# Altium schematic sheet P1.schdoc
size 297 x 209 mm; Symbol: Drawing-Symbol_A4; Company: 嘉立创EDA; Version: V1.0; Page Size: A4; @Project Name: mini_scale; @Update Date: 2026-07-24; @Create Date: 2026-07-24; Device: Drawing-Symbol_A4; @Board Name: Board1; @Page Name: P1; @Create Time: 00:33:53; @Page Count: 1; @Page No: 1; @Schematic Name: Schematic1; @Update Time: 00:33:53; @Assembly Variant: Basic; Border: 1; Title Block Position: 3; Size: A4; Width: 1170; Height: 825; Region Start: 1; X Region Count: 6; Y Region Count: 4; Blade Width: 10; SheetNumber: 1; SheetTotal: 1
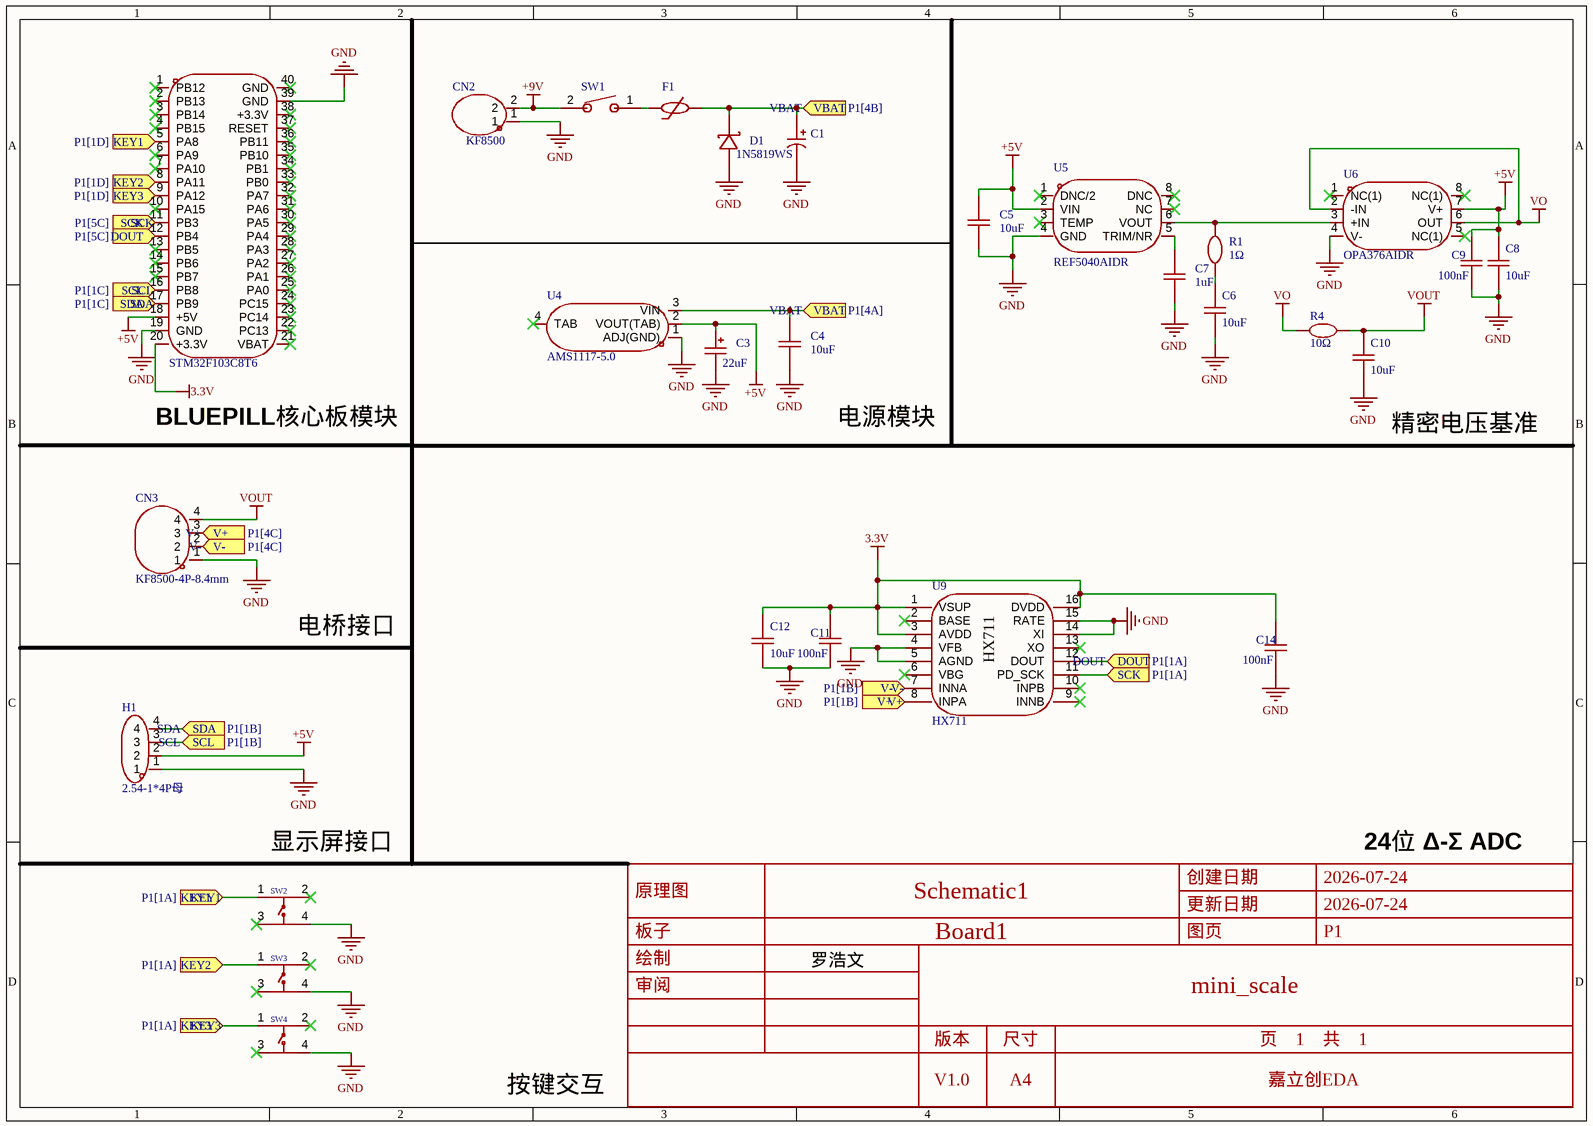
[diagram p0: P1.schdoc]

## Parts
C1  100uF  [CAP-SMD_BD6.3-L6.6-W6.6-FD-1]  (value not drawn)
C3  22uF  [CASE-A_3216]
C4  10uF  [C0805]
C5  10uF  [C0805]
C6  10uF  [C0805]
C7  1uF  [C0805]
C8  10uF  [C0805]
C9  100nF  [C0402]
C10  10uF  [C0805]
C11  100nF  [C0402]
C12  10uF  [C0805]
C14  100nF  [C0402]
CN2  KF8500  [CONN-TH_KF8500-2P-8.4MM]
CN3  KF8500-4P-8.4mm  [CONN-TH_KF8500-4P-8.4MM]
D1  1N5819WS  [SOD-323_L1.8-W1.3-LS2.5-RD]
F1  SMD0805-100-12  [R0805]  (value not drawn)
H1  2.54-1*4P母  [HDR-TH_4P-P2.54-V-F]
R1  1Ω  [R1206]
R4  10Ω  [R0805]
SW1  RS601HL-1010011BB  [SW-TH_RS601HL-1010011BB]  (value not drawn)
SW2  TS1603-TZ60HBM  [SW-SMD_4P-L4.5-W4.5-P3.00-LS6.8-1]  (value not drawn)
SW3  TS1603-TZ60HBM  [SW-SMD_4P-L4.5-W4.5-P3.00-LS6.8-1]  (value not drawn)
SW4  TS1603-TZ60HBM  [SW-SMD_4P-L4.5-W4.5-P3.00-LS6.8-1]  (value not drawn)
U2  STM32F103C8T6  [CONN-TH_L53.3-W22.9_STM32F103C8T6-CARD]
U4  AMS1117-5.0  [SOT-223_L6.7-W3.5-P2.30-BR]
U5  REF5040AIDR  [SOIC-8_L4.9-W3.9-P1.27-LS6.0-BL]
U6  OPA376AIDR  [SOIC-8_L4.9-W3.9-P1.27-LS6.0-BL]
U9  HX711  [SOP-16_L10.0-W3.9-P1.27-LS6.0-BL]

## Ports
DOUT (in, see P1[1A]), DOUT (in, see P1[5C]), KEY1 (in, see P1[1A]), KEY1 (in, see P1[1D]), KEY2 (in, see P1[1A]), KEY2 (in, see P1[1D]), KEY3 (in, see P1[1A]), KEY3 (in, see P1[1D]), SCK (in, see P1[1A]), SCK (in, see P1[5C]), SCL (in, see P1[1B]), SCL (in, see P1[1C]), SDA (in, see P1[1B]), SDA (in, see P1[1C]), V+ (in, see P1[1B]), V+ (in, see P1[4C]), V- (in, see P1[1B]), V- (in, see P1[4C]), VBAT (in, see P1[4A]), VBAT (in, see P1[4B])

## Nets
3.3V: C11.2 C12.2 C14.2 U2.20(+3.3V) U9.1(VSUP) U9.3(AVDD) U9.16(DVDD)
+5V: C3.1 C5.2 C8.2 C9.2 H1.2 U2.18(+5V) U4.2(VOUT(TAB)) U5.2(VIN) U6.7(V+)
+9V: CN2.2 SW1.2
GND: C1.2 C3.2 C4.1 C5.1 C6.1 C7.1 C8.1 C9.1 C10.1 C11.1 C12.1 C14.1 CN2.1 CN3.1 D1.2(A) H1.1 SW2.4 SW3.4 SW4.4 U2.19(GND) U2.39(GND) U4.1(ADJ(GND)) U5.4(GND) U6.4(V-) U9.4(VFB) U9.5(AGND) U9.14(XI) U9.15(RATE)
VO: R4.1 U6.2(-IN) U6.6(OUT)
VOUT: C10.2 CN3.4 R4.2
DOUT: U2.12(PB4) U9.12(DOUT) ; port DOUT
KEY1: SW2.1 U2.5(PA8) ; port KEY1
KEY2: SW3.1 U2.8(PA11) ; port KEY2
KEY3: SW4.1 U2.9(PA12) ; port KEY3
SCK: U2.11(PB3) U9.11(PD_SCK) ; port SCK
SCL: H1.3 U2.16(PB8) ; port SCL
SDA: H1.4 U2.17(PB9) ; port SDA
V+: CN3.3 U9.8(INPA) ; port V+
V-: CN3.2 U9.7(INNA) ; port V-
VBAT: C1.1 C4.2 D1.1(K) F1.2 U4.3(VIN) ; port VBAT
NetC6_2: C6.2 R1.1
NetC7_2: C7.2 U5.5(TRIM/NR)
NetF1_1: F1.1 SW1.1
NetR1_2: R1.2 U5.6(VOUT) U6.3(+IN)

Not connected (* = marked no-connect by the designer): SW2 2* 3*; SW3 2* 3*; SW4 2* 3*; U2 1(PB12)* 2(PB13)* 3(PB14)* 4(PB15)* 6(PA9)* 7(PA10)* 10(PA15)* 13(PB5)* 14(PB6)* 15(PB7)* 21(VBAT)* 22(PC13)* 23(PC14)* 24(PC15)* 25(PA0)* 26(PA1)* 27(PA2)* 28(PA3)* 29(PA4)* 30(PA5)* 31(PA6)* 32(PA7)* 33(PB0)* 34(PB1)* 35(PB10)* 36(PB11)* 37(RESET)* 38(+3.3V)* 40(GND)*; U4 4(TAB)*; U5 1(DNC/2)* 3(TEMP)* 7(NC)* 8(DNC)*; U6 1(NC(1))* 5(NC(1))* 8(NC(1))*; U9 2(BASE)* 6(VBG)* 9(INNB)* 10(INPB)* 13(XO)*

## Notes on the sheet
- BLUEPILL核心板模块
- 电源模块
- (near C10) 精密电压基准
- 电桥接口
- (near SW2) 显示屏接口
- 24位 Δ-Σ ADC
- 罗浩文
- 按键交互
- 创建日期
- 2026-07-24
- 原理图
- 板子
- Schematic1
- Board1
- 更新日期
- 图页
- P1
- 绘制
- 审阅
- mini_scale
- 版本
- V1.0
- 尺寸
- A4
- 页    1    共    1
- 嘉立创EDA

## Library data of the parts
C1 = JVJ25V100M6x5: 容值:100uF;精度:±20%;额定电压:25V;纹波电流:72mA@120Hz;; Manufacturer: JIERR(捷而瑞); AddInBom: yes; ModelId: 041333f082e2432d92aae8a67d233574|0819f05c4eef4c71ace90d822a990e87; ModelTransform: 299.212,259.842,0,0,0,0,0,0,0; Tolerance: ±20%; Voltage Rating: 25V; Lifetime: 2000hrs@105℃; Symbol: JVJ25V100M6X5; Device: JVJ25V100M6x5; LCSC Part Name: 100uF ±20% 25V; SupplierPart: C46550402; ManufacturerPart: JVJ25V100M6x5; Supplier Footprint: SMD,D6.3xL5.4mm; JLCPCB Part Class: Extended Part; Datasheet: https://item.szlcsc.com/datasheet/JVJ25V100M6x5/48680096.html; Supplier: LCSC; ConvertToPcb: yes; FootprintName: CAP-SMD_BD6.3-L6.6-W6.6-FD-1; ModelName: CAP-SMD_BD6.3-L6.6-W6.6-FD-1; Value: 100uF; Ripple Current: 72mA@120Hz; Diameter: 6.3mm; Height - Seated (Max): 5.4mm; Operating Temperature: -55℃~+105℃
C3 = TAJA226K010RNJ: 容值:22uF;精度:±10%;额定电压:10V;等效串联电阻(ESR):3Ω@100kHz;; Manufacturer: Kyocera AVX; AddInBom: yes; ModelId: 803ac3def75e4c7cb895540fe23dd6a1|0819f05c4eef4c71ace90d822a990e87; ModelTransform: 125.984,62.992,0,0,0,0,0,0,0; Tolerance: ±10%; Voltage Rating: 10V; Symbol: TAJA226K010RNJ; Device: TAJA226K010RNJ; LCSC Part Name: 22uF ±10% 10V; SupplierPart: C11366; ManufacturerPart: TAJA226K010RNJ; Supplier Footprint: CASE-A-3216-18(mm); JLCPCB Part Class: Extended Part; Supplier: LCSC; ConvertToPcb: yes; FootprintName: CASE-A_3216; ModelName: CASE-A_3216; Value: 22uF; Equivalent Series Resistance(ESR): 3Ω@100kHz; Operating Temperature: -55℃~+125℃
C4 = CGA0805X5R106K250MT: 容值:10uF;精度:±10%;额定电压:25V;温度系数:X5R;; Manufacturer: HRE(芯声); AddInBom: yes; ModelId: 1ba041120af144c991958decab20d241|0819f05c4eef4c71ace90d822a990e87; ModelName: C0805_L2.0-W1.3-H1.3; ModelTransform: 78.74,51.181,0,0,0,0,0,0.0005,0; Tolerance: ±10%; Voltage Rating: 25V; Temperature Coefficient: X5R; Symbol: CGA0805X5R106K250MT; Device: CGA0805X5R106K250MT; LCSC Part Name: 10uF ±10% 25V; SupplierPart: C6119887; ManufacturerPart: CGA0805X5R106K250MT; Supplier Footprint: 0805; JLCPCB Part Class: Extended Part; Datasheet: https://item.szlcsc.com/datasheet/CGA0805X5R106K250MT/7062593.html; Supplier: LCSC; ConvertToPcb: yes; FootprintName: C0805; Value: 10uF
C5 C6 C8 C10 C12 = CGA0805X5R106K250MT: 容值:10uF;精度:±10%;额定电压:25V;温度系数:X5R;; Manufacturer: HRE(芯声); 3D Model: 1ba041120af144c991958decab20d241|0819f05c4eef4c71ace90d822a990e87; 3D Model Transform: 78.74,51.181,0,0,0,0,0,0.0005,0; Tolerance: ±10%; Voltage Rating: 25V; Temperature Coefficient: X5R; AddInBom: yes; ModelName: C0805_L2.0-W1.3-H1.3; Symbol: CGA0805X5R106K250MT; Device: CGA0805X5R106K250MT; LCSC Part Name: 10uF ±10% 25V; Supplier Part: C6119887; Manufacturer Part: CGA0805X5R106K250MT; Supplier Footprint: 0805; JLCPCB Part Class: Extended Part; Datasheet: https://item.szlcsc.com/datasheet/CGA0805X5R106K250MT/7062593.html; Supplier: LCSC; Value: 10uF; ConvertToPcb: yes; FootprintName: C0805
C7 = CGA0805X7R105K500MT: 容值:1uF;精度:±10%;额定电压:50V;温度系数:X7R;; Manufacturer: HRE(芯声); AddInBom: yes; ModelId: 1ba041120af144c991958decab20d241|0819f05c4eef4c71ace90d822a990e87; ModelName: C0805_L2.0-W1.3-H1.3; ModelTransform: 78.74,51.181,0,0,0,0,0,0.0005,0; Tolerance: ±10%; Voltage Rating: 50V; Temperature Coefficient: X7R; Symbol: CGA0805X7R105K500MT; Device: CGA0805X7R105K500MT; LCSC Part Name: 1uF ±10% 50V; SupplierPart: C6119929; ManufacturerPart: CGA0805X7R105K500MT; Supplier Footprint: 0805; JLCPCB Part Class: Extended Part; Datasheet: https://item.szlcsc.com/datasheet/CGA0805X7R105K500MT/7062635.html; Supplier: LCSC; ConvertToPcb: yes; FootprintName: C0805; Value: 1uF
C9 = CC0402KRX7R7BB104: 容值:100nF;精度:±10%;额定电压:16V;温度系数:X7R;; Manufacturer: YAGEO(国巨); AddInBom: yes; ModelId: 36a51122f27c49738f86b3bfa98863e0|0819f05c4eef4c71ace90d822a990e87; ModelName: C0402_L1.0-W0.5-H0.5; ModelTransform: 39.37,19.685,0,0,0,0,0,0,0; Tolerance: ±10%; Voltage Rating: 16V; Temperature Coefficient: X7R; Symbol: CC0402KRX7R7BB104; Device: CC0402KRX7R7BB104; LCSC Part Name: 100nF ±10% 16V; SupplierPart: C60474; ManufacturerPart: CC0402KRX7R7BB104; Supplier Footprint: 0402; JLCPCB Part Class: Extended Part; Datasheet: https://item.szlcsc.com/datasheet/CC0402KRX7R7BB104/61526.html; Supplier: LCSC; ConvertToPcb: yes; FootprintName: C0402; Value: 100nF
C11 C14 = CC0402KRX7R7BB104: 容值:100nF;精度:±10%;额定电压:16V;温度系数:X7R;; Manufacturer: YAGEO(国巨); 3D Model: 36a51122f27c49738f86b3bfa98863e0|0819f05c4eef4c71ace90d822a990e87; 3D Model Transform: 39.37,19.685,0,0,0,0,0,0,0; Tolerance: ±10%; Voltage Rating: 16V; Temperature Coefficient: X7R; AddInBom: yes; ModelName: C0402_L1.0-W0.5-H0.5; Symbol: CC0402KRX7R7BB104; Device: CC0402KRX7R7BB104; LCSC Part Name: 100nF ±10% 16V; Supplier Part: C60474; Manufacturer Part: CC0402KRX7R7BB104; Supplier Footprint: 0402; JLCPCB Part Class: Extended Part; Datasheet: https://item.szlcsc.com/datasheet/CC0402KRX7R7BB104/61526.html; Supplier: LCSC; Value: 100nF; ConvertToPcb: yes; FootprintName: C0402
CN2 = KF8500-2p-8.4MM: 隔板类型:两面;间距:8.5mm;结构:1x2P;安装方式:直插;引脚位置:边脚;排数:1;每排PIN数:2;额定电流:20A;额定电压:300V;线规 - AWG:12~22;线规 - 平方毫米:-;工作温度:-40℃~+105℃;颜色:绿色;; Manufacturer: BOOMELE(博穆精密); AddInBom: yes; ModelId: c30898623fc1485dab84d6a2e80a09f9|0819f05c4eef4c71ace90d822a990e87; ModelTransform: 708.66,472.44,0,0,0,0,19.685,-156.889,-185.039; Barrier Type: 两面; Pitch: 8.5mm; Number of Positions or Pins: 1x2P; Pin Location: 边脚; Number of PINs Per Row: 2; Current Rating: 20A; Voltage Rating (Max): 300V; Wire Gauge - AWG: 12~22; Symbol: KF8500-2P-8.4MM; Device: KF8500-2p-8.4MM; Manufacturer Part: KF8500; LCSC Part Name: 8.5mm 1x2P 直插 边脚 排数:1 每排P数:2; SupplierPart: C42860; Supplier Footprint: 插件,P=8.5mm; JLCPCB Part Class: Extended Part; Datasheet: https://item.szlcsc.com/datasheet/KF8500-2p-8.4MM/43851.html; Supplier: LCSC; ConvertToPcb: yes; FootprintName: CONN-TH_KF8500-2P-8.4MM; ModelName: CONN-TH_KF8500-2P-8.4MM; Mounting Type: 直插; Number of Pins: 2P; Number of Rows: 1; Wire Gauge - mm2: -; Operating Temperature: -40℃~+105℃; Color: 绿色
CN3 = KF8500-4P-8.4mm: Manufacturer: BOOMELE(博穆精密); AddInBom: yes; ModelId: e5b8ee24f4544fd3935b2de5555f3f62|0819f05c4eef4c71ace90d822a990e87; ModelTransform: 1322.83192,496.062,0,0,0,0,0,-133.858,-196.85; Symbol: KF8500-4P-8.4MM; Device: KF8500-4P-8.4mm; LCSC Part Name: 接线端子 KF8500-4P-8.4mm; SupplierPart: C24671; ManufacturerPart: KF8500-4P-8.4mm; Supplier Footprint: 插件,P=8.4mm; JLCPCB Part Class: Extended Part; Supplier: LCSC; ConvertToPcb: yes; FootprintName: CONN-TH_KF8500-4P-8.4MM; ModelName: CONN-TH_KF8500-4P-8.4MM
D1 = 1N5819WS_C191023: 正向压降(Vf):600mV@1A;直流反向耐压(Vr):40V;整流电流:1A;; Manufacturer: Hottech(合科泰); AddInBom: yes; ModelId: db63db13d9e342eb939127d413d6200b|0819f05c4eef4c71ace90d822a990e87; ModelTransform: 104.3305,51.181,0,0,0,0,0,-0.004,0; Voltage - DC Reverse(Vr): 40V; Current - Rectified: 1A; Non-Repetitive Peak Forward Surge Current: 25A; Symbol: 1N5819WS; Device: 1N5819WS_C191023; LCSC Part Name: 电压:40V 电流:1A; SupplierPart: C191023; ManufacturerPart: 1N5819WS; Supplier Footprint: SOD-323; JLCPCB Part Class: Basic Part; Datasheet: https://item.szlcsc.com/datasheet/1N5819WS/213850.html; Supplier: LCSC; ConvertToPcb: yes; FootprintName: SOD-323_L1.8-W1.3-LS2.5-RD; ModelName: SOD-323_L1.8-W1.3-LS2.5-RD; Voltage - Forward(Vf@If): 600mV@1A
F1 = SMD0805-100-12: 耐压(Vmax):12V;最大电流(Imax):40A;保持电流(Ihold):1A;跳闸电流(Itrip):2A;; Manufacturer: R+O(宏嘉诚); AddInBom: yes; ModelId: 37a81e68749a4138bd2dfa6897b24b85|0819f05c4eef4c71ace90d822a990e87; ModelName: R0805_L2.0-W1.3-H0.6; ModelTransform: 78.74,51.181,0,0,0,0,0,-0.0005,0; Voltage - Max: 12V; Current - Max: 40A; Hold Current: 1A; Trip Current: 2A; Power Dissipation: 600mW; Resistance - Initial (Ri) (Min): 40mΩ; Resistance - Post Trip (R1) (Max): 270mΩ; Time to Trip(Max): 300ms; Symbol: SMD0805-100-12; Device: SMD0805-100-12; LCSC Part Name: 12V 1A; SupplierPart: C46640991; ManufacturerPart: SMD0805-100-12; Supplier Footprint: 0805; JLCPCB Part Class: Extended Part; Datasheet: https://item.szlcsc.com/datasheet/SMD0805-100-12/48798697.html; Supplier: LCSC; ConvertToPcb: yes; FootprintName: R0805; Operating Temperature: -40℃~+85℃; Length: 2.2mm; Width: 1.5mm
H1 = 2.54-1*4P母: 插孔结构:1x4P;间距:2.54mm;行距:-;圆孔/方孔:方孔;安装方式:直插;排数:单排;总孔位数:4P;额定电流:3A;额定电压:-;插孔方向:顶部;塑高:-;触头材质:青铜;触头镀层:-;工作温度:-40℃~+105℃;; Manufacturer: BOOMELE(博穆精密); AddInBom: yes; ModelId: d187812051054f85879fcaa51a310d8e|0819f05c4eef4c71ace90d822a990e87; ModelTransform: 419.6842,98.464,0,0,0,0,0,0,-118.11; Holes Structure: 1x4P; Pitch: 2.54mm; Circular Hole / Square Hole: 方孔; Number of Positions: 4P; Current Rating: 3A; Holes Direction: 顶部; Symbol: 2.54-1*4P母; Device: 2.54-1*4P母; LCSC Part Name: 间距:2.54mm 1x4P 直插; SupplierPart: C2718488; ManufacturerPart: 2.54-1*4P母; Supplier Footprint: 插件,P=2.54mm; JLCPCB Part Class: Extended Part; Datasheet: https://item.szlcsc.com/datasheet/2.54-1*4P%25E6%25AF%258D/2834502.html; Supplier: LCSC; ConvertToPcb: yes; FootprintName: HDR-TH_4P-P2.54-V-F; ModelName: HDR-TH_4P-P2.54-V-F; Row Spacing: -; Mounting Type: 直插; Number of Rows: 单排; Voltage Rating (Max): -; Insulation Height: -; Contact Material: 青铜; Contact Plating: -; Operating Temperature: -40℃~+105℃
R1 = FRC1206J1R0 TS: 电阻类型:厚膜电阻;阻值:1Ω;精度:±5%;功率:250mW;工作电压:200V;温度系数:±400ppm/℃;; Manufacturer: FOJAN(富捷); AddInBom: yes; ModelId: 89a1f13db2384da588040e0b3c55bf66|0819f05c4eef4c71ace90d822a990e87; ModelName: R1206_L3.2-W1.6-H0.6; ModelTransform: 125.984,62.992,0,0,0,0,0,0,0; Tolerance: ±5%; Power(Watts): 250mW; Voltage-Supply(Max): 200V; Symbol: FRC1206J1R0 TS; Device: FRC1206J1R0 TS; LCSC Part Name: 1Ω ±5% 250mW 厚膜电阻; SupplierPart: C2907442; ManufacturerPart: FRC1206J1R0 TS; Supplier Footprint: 1206; JLCPCB Part Class: Extended Part; Datasheet: https://item.szlcsc.com/datasheet/FRC1206J1R0%2520TS/3180955.html; Supplier: LCSC; ConvertToPcb: yes; FootprintName: R1206; Type: 厚膜电阻; Value: 1Ω; Temperature Coefficient: ±400ppm/℃; Operating Temperature: -55℃~+155℃
R4 = FRC0805J100 TS: 电阻类型:厚膜电阻;阻值:10Ω;精度:±5%;功率:125mW;工作电压:150V;温度系数:±200ppm/℃;; Manufacturer: FOJAN(富捷); AddInBom: yes; ModelId: 37a81e68749a4138bd2dfa6897b24b85|0819f05c4eef4c71ace90d822a990e87; ModelName: R0805_L2.0-W1.3-H0.6; ModelTransform: 78.74,51.181,0,0,0,0,0,-0.0005,0; Tolerance: ±5%; Power(Watts): 125mW; Voltage-Supply(Max): 150V; Symbol: FRC0805J100 TS; Device: FRC0805J100 TS; LCSC Part Name: 10Ω ±5% 125mW 厚膜电阻; SupplierPart: C2907296; ManufacturerPart: FRC0805J100 TS; Supplier Footprint: 0805; JLCPCB Part Class: Extended Part; Datasheet: https://item.szlcsc.com/datasheet/FRC0805J100%2520TS/3180809.html; Supplier: LCSC; ConvertToPcb: yes; FootprintName: R0805; Type: 厚膜电阻; Value: 10Ω; Temperature Coefficient: ±200ppm/℃; Operating Temperature: -55℃~+155℃
SW1 = RS601HL-1010011BB: 带灯:无;引脚样式:焊片;额定电流:3A;额定电压(AC):250V;额定电压(DC):-;电路结构:单刀单掷;工作寿命:1万次;; Manufacturer: HCTL(华灿天禄); AddInBom: yes; ModelId: cac6664e7827407e8024fa0ea95caa3c|0819f05c4eef4c71ace90d822a990e87; ModelTransform: 590.55,413.385,0,0,0,0,97.83,0,-196.85; Actuator Type: 凹面弯曲; With Lamp: 无; Actuator Color: 黑色; Current Rating: 3A; Voltage Rating (AC): 250V; Circuit: 单刀单掷; Life: 1万次; Actuator Identifier: - O; Symbol: RS601HL-1010011BB; Device: RS601HL-1010011BB; LCSC Part Name: RS601HL-1010011BB; SupplierPart: C2885782; ManufacturerPart: RS601HL-1010011BB; Supplier Footprint: 插件,15x10.5mm; JLCPCB Part Class: Extended Part; Datasheet: https://item.szlcsc.com/datasheet/RS601HL-1010011BB/3096684.html; Supplier: LCSC; ConvertToPcb: yes; FootprintName: SW-TH_RS601HL-1010011BB; ModelName: SW-TH_RS601HL-1010011BB; Length: 15mm; Width: 10.5mm; Switch Height: -; Termination Style: 焊片; Voltage Rating (DC): -; Operating Temperature: -25℃~+85℃
SW2-SW4 = TS1603-TZ60HBM: 电路结构:单刀单掷;按钮形状:圆形按钮;安装方式:立贴;开关长度:4.5mm;开关宽度:4.5mm;开关高度:6mm;带支架:不带支架;触点电流:50mA;额定电压:12V;带灯:无;; Manufacturer: BXCONN(宝讯); AddInBom: yes; ModelId: 725d6a1b23d74dddbea84bcfb83358d8|0819f05c4eef4c71ace90d822a990e87; ModelTransform: 267.716,177.559,0,0,0,0,0,0,0; Circuit: 单刀单掷; Actuator Style: 圆形按钮; Switch Height: 6mm; with Bracket: 不带支架; Contact Current: 50mA; Voltage Rating: 12V; Actuator/Cap Color: 黑色; With Lamp: 无; Symbol: TS1603-TZ60HBM; Device: TS1603-TZ60HBM; LCSC Part Name: 4.5*4.5*6.0 立贴   轻触开关; SupplierPart: C36938891; ManufacturerPart: TS1603-TZ60HBM; Supplier Footprint: SMD-4P,4.5x4.5mm; JLCPCB Part Class: Extended Part; Datasheet: https://item.szlcsc.com/datasheet/TS1603-TZ60HBM/38663761.html; Supplier: LCSC; ConvertToPcb: yes; FootprintName: SW-SMD_4P-L4.5-W4.5-P3.00-LS6.8-1; ModelName: SW-SMD_4P-L4.5-W4.5-P3.00-LS6.8-1; Mounting Type: 立贴; Length: 4.5mm; Width: 4.5mm; Termination Style: 鸥翼型
U2 = LCKFB-DKX-STM32F103C8T6: 搭载Contex M3内核,程序存储容量64KB,RAM总容量20KB,最高72MHz主频,提供高效的计算能力和稳定的运行环境。; Manufacturer: 立创开发板; AddInBom: yes; ModelId: 70cdd142a616427fa7f75b03dcb28559|0819f05c4eef4c71ace90d822a990e87; ModelTransform: 2310.042,898.9982,0,0,0,0,90.551,0,-236.22; Symbol: LCKFB-DKX-STM32F103C8T6; Device: LCKFB-DKX-STM32F103C8T6; Manufacturer Part: STM32F103C8T6; LCSC Part Name: 立创·地阔星-STM32F103C8T6开发板; SupplierPart: C22396880; Supplier Footprint: -; JLCPCB Part Class: Extended Part; Datasheet: https://item.szlcsc.com/datasheet/LCKFB-DKX-STM32F103C8T6/24005615.html; Supplier: LCSC; ConvertToPcb: yes; FootprintName: CONN-TH_L53.3-W22.9_STM32F103C8T6-CARD; ModelName: CONN-TH_L53.3-W22.9_STM32F103C8T6-CARD
U4 = AMS1117-5.0_C347223: 输出极性:正极;工作电压:12V;输出电压:5V;输出电流:1A;电源纹波抑制比(PSRR):60dB@(120Hz);输出类型:固定;; Manufacturer: UMW(友台半导体); AddInBom: yes; ModelId: 925194bf9823436183a3e0b978a8d076|0819f05c4eef4c71ace90d822a990e87; ModelName: SOT-223-4P_L6.5-W3.5-H1.6-LS7.0-P2.30; ModelTransform: 279.89794,255.905,0,180,0,0,0,0,0; Output Configuration: 正极; Voltage - Supply: 12V; Output Voltage: 5V; Output Current: 1A; Voltage Dropout: 1.3V@(1A); standby current: 5mA; Noise: 0.003%Vout; Output Type: 固定; Number of Outputs: 1; Symbol: AMS1117-5.0_C347223; Device: AMS1117-5.0_C347223; LCSC Part Name: 5V 1A 12V; SupplierPart: C347223; ManufacturerPart: AMS1117-5.0; Supplier Footprint: SOT-223; JLCPCB Part Class: Extended Part; Datasheet: https://item.szlcsc.com/datasheet/AMS1117-5.0/323883.html; Supplier: LCSC; ConvertToPcb: yes; FootprintName: SOT-223_L6.7-W3.5-P2.30-BR; Power Supply Rejection Ratio (PSRR): 60dB@(120Hz); Features: 过流保护; Operating Temperature: -40℃~+125℃
U5 = REF5040AIDR: 输出类型:固定;工作电压:4.296V~18V;输出电压:4.096V;输出电流:10mA;精度:±0.1%;; Manufacturer: TI(德州仪器); AddInBom: yes; ModelId: e81d2f7d937b4a6ab1dca543ff5d56a4|0819f05c4eef4c71ace90d822a990e87; ModelName: SOIC-8_L4.9-W3.9-H1.7-LS6.0-P1.27; ModelTransform: 192.913,236.22,0,0,0,0,0,0,0; Output Type: 固定; Output Voltage: 4.096V; Output Current: 10mA; Tolerance: ±0.1%; Temperature Coefficient: 8ppm/℃; Reference Type: 串联; Quiescent Current: 1.2mA; Noise - 1/10Hz to 10Hz: 12uVp-p; Symbol: REF5040; Device: REF5040AIDR; LCSC Part Name: 4.296V~18V 串联 1.2mA 8ppm/℃; SupplierPart: C46274; ManufacturerPart: REF5040AIDR; Supplier Footprint: SOIC-8; JLCPCB Part Class: Extended Part; Datasheet: https://www.ti.com.cn/cn/lit/ds/symlink/ref50.pdf; Supplier: LCSC; ConvertToPcb: yes; FootprintName: SOIC-8_L4.9-W3.9-P1.27-LS6.0-BL; Voltage - Supply: 4.296V~18V; Minimum Cathode Current for Regulation: -; Noise - 10Hz to 10kHz: -; Operating Temperature: -40℃~+125℃@(Ta)
U6 = OPA376AIDR: 放大器数:单路;增益带宽积(GBP):5.5MHz;输入偏置电流(Ib):0.2pA;输入失调电压(Vos):5uV;压摆率(SR):2V/us;轨到轨:轨到轨输入,轨到轨输出;; Manufacturer: TI(德州仪器); AddInBom: yes; ModelId: e81d2f7d937b4a6ab1dca543ff5d56a4|0819f05c4eef4c71ace90d822a990e87; ModelName: SOIC-8_L4.9-W3.9-H1.7-LS6.0-P1.27; ModelTransform: 192.913,236.22,0,0,0,0,0,0,0; Number of Channels: 单路; Gain Bandwidth Product: 5.5MHz; Ib - Input Bias Current: 0.2pA; Vos - Input Offset Voltage: 5uV; Common Mode Rejection Ratio(CMRR): 90dB; Slew Rate: 2V/us; Output Current: 30mA; Input Offset Voltage Drift(Vos TC): 260nV/℃; Quiescent Current(Iq): 760uA; Single Supply: 2.2V~5.5V; Maximum Power Supply Range (Vdd-Vss): 5.5V; Noise density(eN): 7.5nV/√Hz@1kHz; Symbol: OPA376AIDR; Device: OPA376AIDR; LCSC Part Name: OPAx376 低噪声、低静态电流、精密运算放大器; SupplierPart: C2058339; ManufacturerPart: OPA376AIDR; Supplier Footprint: SOIC-8; JLCPCB Part Class: Extended Part; Datasheet: https://www.ti.com/cn/lit/gpn/opa2376; Supplier: LCSC; ConvertToPcb: yes; FootprintName: SOIC-8_L4.9-W3.9-P1.27-LS6.0-BL; Rail to Rail: 轨到轨输入,轨到轨输出; Operating Temperature: -40℃~+125℃; Input Offset Current(Ios): 0.2pA
U9 = HX711: 分辨率(位):24;采样率:10Hz;工作电压:2.6V~5.5V;接口类型:串口;; Manufacturer: AVIA(海芯科技); AddInBom: yes; ModelId: 3361a6792abf4a8f8fbca4f1924a67ee|0819f05c4eef4c71ace90d822a990e87; ModelName: SOP-16_L9.9-W3.9-H1.5-LS6.0-P1.27; ModelTransform: 240.39054,393.7,0,90,0,0,0,0,0; Resolution (Bits): 24; Sampling Rate: 10Hz; number of channels: 2; Interface: 串口; differential input: 是; Clock/Oscillator: 内置；外置; Clock Frequency: 1MHz~20MHz；11.0592MHz; Voltage Reference: 内置; Programmable Gain: 支持; Data rate: 80Hz；10Hz; Quiescent Current (Iq): 2uA; Full-Scale Range(FSR): 20mV；40mV; Symbol: HX711; Device: HX711; LCSC Part Name: 用于称重秤的24bit 模数转换器（ADC）; SupplierPart: C43656; ManufacturerPart: HX711; Supplier Footprint: SOP-16; JLCPCB Part Class: Extended Part; Datasheet: https://item.szlcsc.com/datasheet/HX711/44649.html; Supplier: LCSC; ConvertToPcb: yes; FootprintName: SOP-16_L10.0-W3.9-P1.27-LS6.0-BL; Voltage - Supply: 2.6V~5.5V; Integral non - linearity: -; Operating Temperature: -40℃~+85℃; Signal-to-Noise Ratio: -; Voltage Reference Drift: -; Temperature Sensors: -; ADC architecture: -